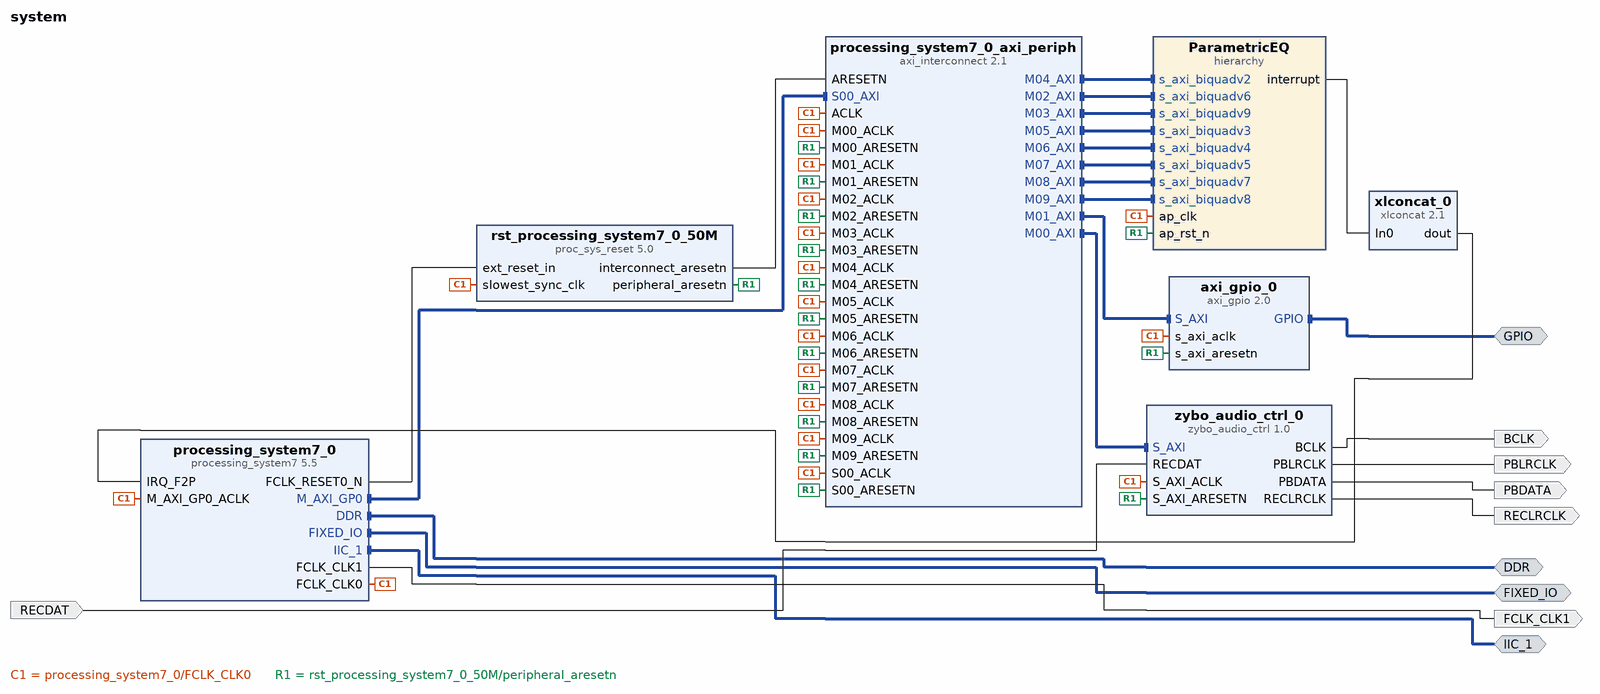
[diagram p0: block diagram of the top level]
# Vivado block design system, xc7z010clg400-1, Vivado 2017.2
create_bd_design system

create_bd_intf_port -mode Master -vlnv xilinx.com:interface:ddrx_rtl:1.0 DDR
create_bd_intf_port -mode Master -vlnv xilinx.com:display_processing_system7:fixedio_rtl:1.0 FIXED_IO
create_bd_intf_port -mode Master -vlnv xilinx.com:interface:iic_rtl:1.0 IIC_1
create_bd_intf_port -mode Master -vlnv xilinx.com:interface:gpio_rtl:1.0 GPIO
create_bd_port -dir O BCLK
create_bd_port -dir O PBLRCLK
create_bd_port -dir O RECLRCLK
create_bd_port -dir O PBDATA
create_bd_port -dir I RECDAT
create_bd_port -dir O -type clk FCLK_CLK1

create_bd_cell -type ip -vlnv xilinx.com:ip:processing_system7:5.5 processing_system7_0
set_property -dict [list \
  CONFIG.PCW_UIPARAM_DDR_FREQ_MHZ 525 \
  CONFIG.PCW_CRYSTAL_PERIPHERAL_FREQMHZ 50.000000 \
  CONFIG.PCW_APU_PERIPHERAL_FREQMHZ 650 \
  CONFIG.PCW_FPGA0_PERIPHERAL_FREQMHZ 100 \
  CONFIG.PCW_FPGA1_PERIPHERAL_FREQMHZ 12.288 \
  CONFIG.PCW_USE_FABRIC_INTERRUPT 1 \
  CONFIG.PCW_EN_CLK1_PORT 1 \
  CONFIG.PCW_IRQ_F2P_INTR 1 \
  CONFIG.PCW_GP0_EN_MODIFIABLE_TXN 0 \
  CONFIG.PCW_GP1_EN_MODIFIABLE_TXN 0 \
  CONFIG.PCW_PRESET_BANK1_VOLTAGE {LVCMOS 1.8V} \
  CONFIG.PCW_UIPARAM_DDR_PARTNO {MT41K128M16 JT-125} \
  CONFIG.PCW_QSPI_PERIPHERAL_ENABLE 0 \
  CONFIG.PCW_ENET0_PERIPHERAL_ENABLE 0 \
  CONFIG.PCW_SD0_PERIPHERAL_ENABLE 0 \
  CONFIG.PCW_UART1_PERIPHERAL_ENABLE 1 \
  CONFIG.PCW_UART1_UART1_IO {MIO 48 .. 49} \
  CONFIG.PCW_USB0_PERIPHERAL_ENABLE 0 \
  CONFIG.PCW_I2C1_PERIPHERAL_ENABLE 1 \
  CONFIG.PCW_I2C1_I2C1_IO EMIO \
  CONFIG.PCW_GPIO_MIO_GPIO_ENABLE 0 \
] [get_bd_cells processing_system7_0]
# 44 more settings of processing_system7_0 are not shown: defaults, MIO pin electricals, DDR timing, and values the tool derives
create_bd_cell -type ip -vlnv xilinx.com:ip:axi_interconnect:2.1 processing_system7_0_axi_periph
set_property -dict {CONFIG.NUM_MI 10} [get_bd_cells processing_system7_0_axi_periph]
create_bd_cell -type ip -vlnv xilinx.com:ip:proc_sys_reset:5.0 rst_processing_system7_0_50M
create_bd_cell -type ip -vlnv xilinx.com:xilinx:zybo_audio_ctrl:1.0 zybo_audio_ctrl_0
create_bd_cell -type ip -vlnv xilinx.com:ip:axi_gpio:2.0 axi_gpio_0
set_property -dict {CONFIG.C_GPIO_WIDTH 1 CONFIG.C_ALL_INPUTS 0 CONFIG.C_ALL_OUTPUTS 1} [get_bd_cells axi_gpio_0]
create_bd_cell -type ip -vlnv xilinx.com:ip:xlconcat:2.1 xlconcat_0
set_property -dict {CONFIG.NUM_PORTS 1} [get_bd_cells xlconcat_0]
create_bd_cell -type hier ParametricEQ

# ---- hierarchy /ParametricEQ ----
current_bd_instance /ParametricEQ
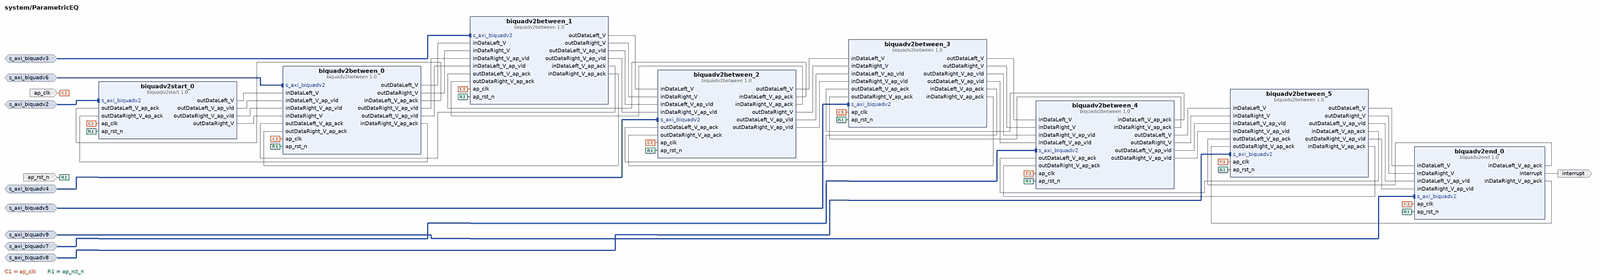
[diagram p1: block diagram inside /ParametricEQ, whole]
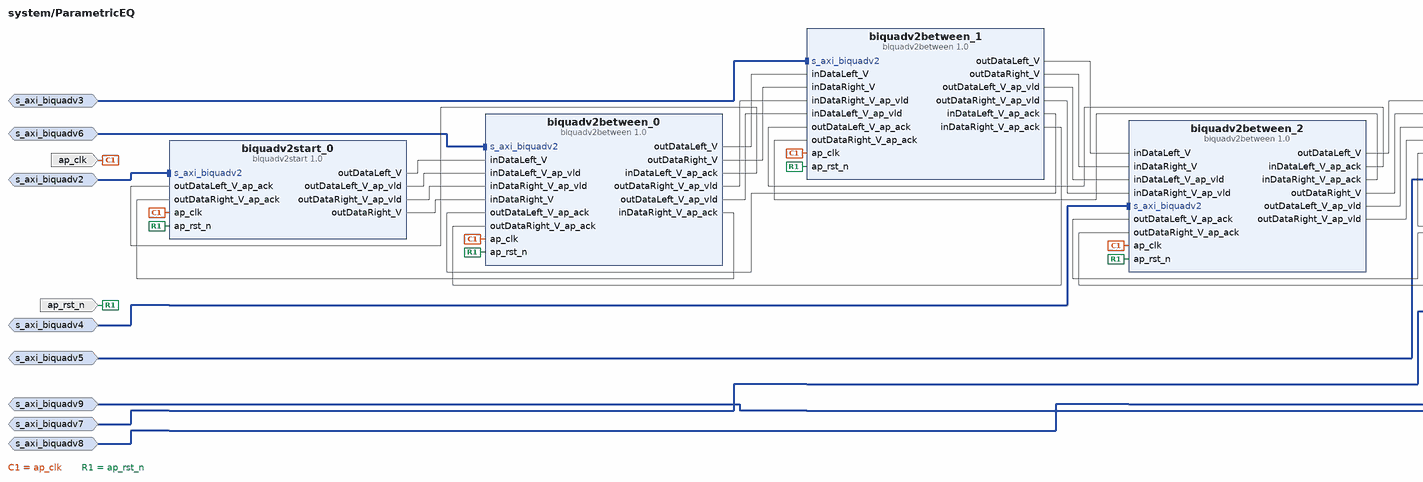
[diagram p2: block diagram inside /ParametricEQ, left part]
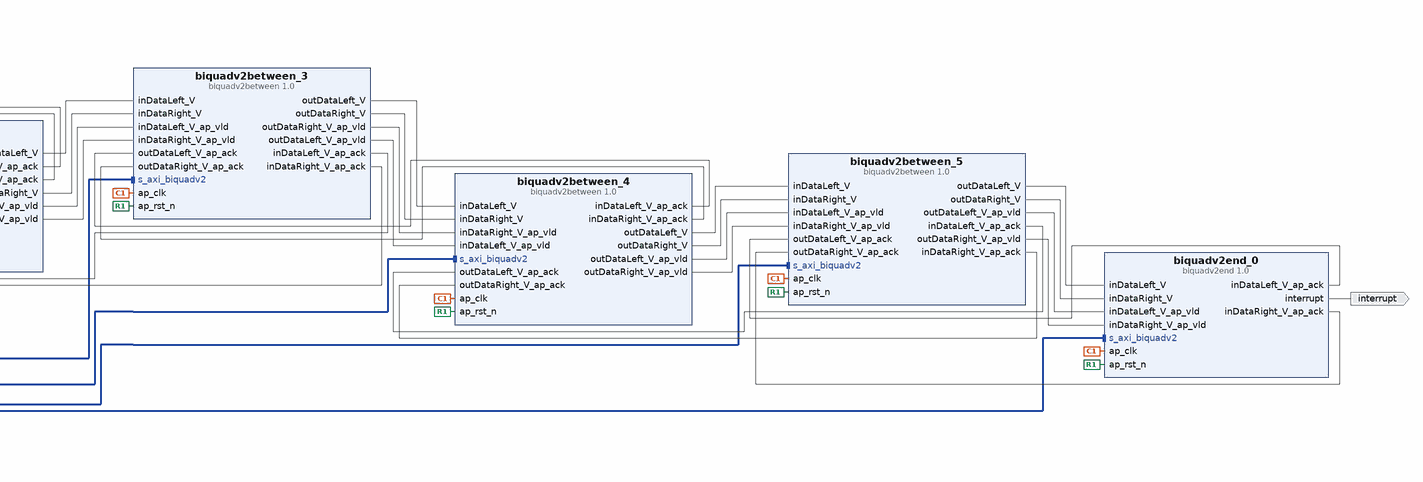
[diagram p3: block diagram inside /ParametricEQ, right part]
create_bd_intf_pin -mode Slave -vlnv xilinx.com:interface:aximm_rtl:1.0 s_axi_biquadv2
create_bd_intf_pin -mode Slave -vlnv xilinx.com:interface:aximm_rtl:1.0 s_axi_biquadv6
create_bd_intf_pin -mode Slave -vlnv xilinx.com:interface:aximm_rtl:1.0 s_axi_biquadv9
create_bd_intf_pin -mode Slave -vlnv xilinx.com:interface:aximm_rtl:1.0 s_axi_biquadv3
create_bd_intf_pin -mode Slave -vlnv xilinx.com:interface:aximm_rtl:1.0 s_axi_biquadv4
create_bd_intf_pin -mode Slave -vlnv xilinx.com:interface:aximm_rtl:1.0 s_axi_biquadv5
create_bd_intf_pin -mode Slave -vlnv xilinx.com:interface:aximm_rtl:1.0 s_axi_biquadv7
create_bd_intf_pin -mode Slave -vlnv xilinx.com:interface:aximm_rtl:1.0 s_axi_biquadv8
create_bd_pin -dir I -type clk ap_clk
create_bd_pin -dir I -type rst ap_rst_n
create_bd_pin -dir O -type intr interrupt

create_bd_cell -type ip -vlnv xilinx.com:hls:biquadv2start:1.0 biquadv2start_0
create_bd_cell -type ip -vlnv xilinx.com:hls:biquadv2between:1.0 biquadv2between_0
create_bd_cell -type ip -vlnv xilinx.com:hls:biquadv2end:1.0 biquadv2end_0
create_bd_cell -type ip -vlnv xilinx.com:hls:biquadv2between:1.0 biquadv2between_1
create_bd_cell -type ip -vlnv xilinx.com:hls:biquadv2between:1.0 biquadv2between_2
create_bd_cell -type ip -vlnv xilinx.com:hls:biquadv2between:1.0 biquadv2between_3
create_bd_cell -type ip -vlnv xilinx.com:hls:biquadv2between:1.0 biquadv2between_4
create_bd_cell -type ip -vlnv xilinx.com:hls:biquadv2between:1.0 biquadv2between_5

# ---- connections ----

current_bd_instance /ParametricEQ
connect_bd_intf_net [get_bd_intf_pins s_axi_biquadv2] [get_bd_intf_pins biquadv2start_0/s_axi_biquadv2]
connect_bd_intf_net [get_bd_intf_pins s_axi_biquadv6] [get_bd_intf_pins biquadv2between_0/s_axi_biquadv2]
connect_bd_intf_net [get_bd_intf_pins s_axi_biquadv9] [get_bd_intf_pins biquadv2end_0/s_axi_biquadv2]
connect_bd_intf_net [get_bd_intf_pins s_axi_biquadv3] [get_bd_intf_pins biquadv2between_1/s_axi_biquadv2]
connect_bd_intf_net [get_bd_intf_pins s_axi_biquadv4] [get_bd_intf_pins biquadv2between_2/s_axi_biquadv2]
connect_bd_intf_net [get_bd_intf_pins s_axi_biquadv5] [get_bd_intf_pins biquadv2between_3/s_axi_biquadv2]
connect_bd_intf_net [get_bd_intf_pins s_axi_biquadv7] [get_bd_intf_pins biquadv2between_4/s_axi_biquadv2]
connect_bd_intf_net [get_bd_intf_pins s_axi_biquadv8] [get_bd_intf_pins biquadv2between_5/s_axi_biquadv2]
connect_bd_net -net biquadv2start_0_left_outDataLeft_V [get_bd_pins biquadv2start_0/outDataLeft_V] [get_bd_pins biquadv2between_0/inDataLeft_V]
connect_bd_net [get_bd_pins ap_clk] \
  [get_bd_pins biquadv2start_0/ap_clk] [get_bd_pins biquadv2between_0/ap_clk] [get_bd_pins biquadv2end_0/ap_clk] \
  [get_bd_pins biquadv2between_1/ap_clk] [get_bd_pins biquadv2between_2/ap_clk] [get_bd_pins biquadv2between_3/ap_clk] \
  [get_bd_pins biquadv2between_4/ap_clk] [get_bd_pins biquadv2between_5/ap_clk]
connect_bd_net [get_bd_pins ap_rst_n] \
  [get_bd_pins biquadv2start_0/ap_rst_n] [get_bd_pins biquadv2between_0/ap_rst_n] [get_bd_pins biquadv2end_0/ap_rst_n] \
  [get_bd_pins biquadv2between_1/ap_rst_n] [get_bd_pins biquadv2between_2/ap_rst_n] [get_bd_pins biquadv2between_3/ap_rst_n] \
  [get_bd_pins biquadv2between_4/ap_rst_n] [get_bd_pins biquadv2between_5/ap_rst_n]
connect_bd_net [get_bd_pins biquadv2end_0/interrupt] [get_bd_pins interrupt]
connect_bd_net -net biquadv2start_0_left_outDataLeft_V_ap_vld [get_bd_pins biquadv2start_0/outDataLeft_V_ap_vld] \
  [get_bd_pins biquadv2between_0/inDataLeft_V_ap_vld]
connect_bd_net -net biquadv2between_0_left_inDataLeft_V_ap_ack [get_bd_pins biquadv2between_0/inDataLeft_V_ap_ack] \
  [get_bd_pins biquadv2start_0/outDataLeft_V_ap_ack]
connect_bd_net -net biquadv2start_0_left_outDataRight_V_ap_vld [get_bd_pins biquadv2start_0/outDataRight_V_ap_vld] \
  [get_bd_pins biquadv2between_0/inDataRight_V_ap_vld]
connect_bd_net -net biquadv2start_0_left_outDataRight_V [get_bd_pins biquadv2start_0/outDataRight_V] [get_bd_pins biquadv2between_0/inDataRight_V]
connect_bd_net -net biquadv2between_0_left_inDataRight_V_ap_ack [get_bd_pins biquadv2between_0/inDataRight_V_ap_ack] \
  [get_bd_pins biquadv2start_0/outDataRight_V_ap_ack]
connect_bd_net [get_bd_pins biquadv2between_0/outDataLeft_V] [get_bd_pins biquadv2between_1/inDataLeft_V]
connect_bd_net [get_bd_pins biquadv2between_0/outDataRight_V] [get_bd_pins biquadv2between_1/inDataRight_V]
connect_bd_net [get_bd_pins biquadv2between_0/outDataRight_V_ap_vld] [get_bd_pins biquadv2between_1/inDataRight_V_ap_vld]
connect_bd_net [get_bd_pins biquadv2between_0/outDataLeft_V_ap_vld] [get_bd_pins biquadv2between_1/inDataLeft_V_ap_vld]
connect_bd_net [get_bd_pins biquadv2between_1/inDataLeft_V_ap_ack] [get_bd_pins biquadv2between_0/outDataLeft_V_ap_ack]
connect_bd_net [get_bd_pins biquadv2between_1/inDataRight_V_ap_ack] [get_bd_pins biquadv2between_0/outDataRight_V_ap_ack]
connect_bd_net [get_bd_pins biquadv2between_1/outDataLeft_V] [get_bd_pins biquadv2between_2/inDataLeft_V]
connect_bd_net [get_bd_pins biquadv2between_1/outDataRight_V] [get_bd_pins biquadv2between_2/inDataRight_V]
connect_bd_net [get_bd_pins biquadv2between_1/outDataLeft_V_ap_vld] [get_bd_pins biquadv2between_2/inDataLeft_V_ap_vld]
connect_bd_net [get_bd_pins biquadv2between_1/outDataRight_V_ap_vld] [get_bd_pins biquadv2between_2/inDataRight_V_ap_vld]
connect_bd_net [get_bd_pins biquadv2between_2/inDataLeft_V_ap_ack] [get_bd_pins biquadv2between_1/outDataLeft_V_ap_ack]
connect_bd_net [get_bd_pins biquadv2between_2/inDataRight_V_ap_ack] [get_bd_pins biquadv2between_1/outDataRight_V_ap_ack]
connect_bd_net [get_bd_pins biquadv2between_2/outDataLeft_V] [get_bd_pins biquadv2between_3/inDataLeft_V]
connect_bd_net [get_bd_pins biquadv2between_2/outDataRight_V] [get_bd_pins biquadv2between_3/inDataRight_V]
connect_bd_net [get_bd_pins biquadv2between_2/outDataLeft_V_ap_vld] [get_bd_pins biquadv2between_3/inDataLeft_V_ap_vld]
connect_bd_net [get_bd_pins biquadv2between_2/outDataRight_V_ap_vld] [get_bd_pins biquadv2between_3/inDataRight_V_ap_vld]
connect_bd_net [get_bd_pins biquadv2between_3/inDataLeft_V_ap_ack] [get_bd_pins biquadv2between_2/outDataLeft_V_ap_ack]
connect_bd_net [get_bd_pins biquadv2between_3/inDataRight_V_ap_ack] [get_bd_pins biquadv2between_2/outDataRight_V_ap_ack]
connect_bd_net [get_bd_pins biquadv2between_3/outDataLeft_V] [get_bd_pins biquadv2between_4/inDataLeft_V]
connect_bd_net [get_bd_pins biquadv2between_3/outDataRight_V] [get_bd_pins biquadv2between_4/inDataRight_V]
connect_bd_net [get_bd_pins biquadv2between_3/outDataRight_V_ap_vld] [get_bd_pins biquadv2between_4/inDataRight_V_ap_vld]
connect_bd_net [get_bd_pins biquadv2between_3/outDataLeft_V_ap_vld] [get_bd_pins biquadv2between_4/inDataLeft_V_ap_vld]
connect_bd_net [get_bd_pins biquadv2between_4/inDataLeft_V_ap_ack] [get_bd_pins biquadv2between_3/outDataLeft_V_ap_ack]
connect_bd_net [get_bd_pins biquadv2between_4/inDataRight_V_ap_ack] [get_bd_pins biquadv2between_3/outDataRight_V_ap_ack]
connect_bd_net [get_bd_pins biquadv2between_4/outDataLeft_V] [get_bd_pins biquadv2between_5/inDataLeft_V]
connect_bd_net [get_bd_pins biquadv2between_4/outDataRight_V] [get_bd_pins biquadv2between_5/inDataRight_V]
connect_bd_net [get_bd_pins biquadv2between_4/outDataLeft_V_ap_vld] [get_bd_pins biquadv2between_5/inDataLeft_V_ap_vld]
connect_bd_net [get_bd_pins biquadv2between_4/outDataRight_V_ap_vld] [get_bd_pins biquadv2between_5/inDataRight_V_ap_vld]
connect_bd_net [get_bd_pins biquadv2between_5/inDataLeft_V_ap_ack] [get_bd_pins biquadv2between_4/outDataLeft_V_ap_ack]
connect_bd_net [get_bd_pins biquadv2between_5/inDataRight_V_ap_ack] [get_bd_pins biquadv2between_4/outDataRight_V_ap_ack]
connect_bd_net [get_bd_pins biquadv2between_5/outDataLeft_V] [get_bd_pins biquadv2end_0/inDataLeft_V]
connect_bd_net [get_bd_pins biquadv2between_5/outDataRight_V] [get_bd_pins biquadv2end_0/inDataRight_V]
connect_bd_net [get_bd_pins biquadv2between_5/outDataLeft_V_ap_vld] [get_bd_pins biquadv2end_0/inDataLeft_V_ap_vld]
connect_bd_net [get_bd_pins biquadv2between_5/outDataRight_V_ap_vld] [get_bd_pins biquadv2end_0/inDataRight_V_ap_vld]
connect_bd_net [get_bd_pins biquadv2end_0/inDataLeft_V_ap_ack] [get_bd_pins biquadv2between_5/outDataLeft_V_ap_ack]
connect_bd_net [get_bd_pins biquadv2end_0/inDataRight_V_ap_ack] [get_bd_pins biquadv2between_5/outDataRight_V_ap_ack]

current_bd_instance /
connect_bd_intf_net [get_bd_intf_pins processing_system7_0/M_AXI_GP0] [get_bd_intf_pins processing_system7_0_axi_periph/S00_AXI]
connect_bd_intf_net [get_bd_intf_pins processing_system7_0_axi_periph/M00_AXI] [get_bd_intf_pins zybo_audio_ctrl_0/S_AXI]
connect_bd_intf_net [get_bd_intf_pins processing_system7_0_axi_periph/M01_AXI] [get_bd_intf_pins axi_gpio_0/S_AXI]
connect_bd_intf_net [get_bd_intf_pins processing_system7_0_axi_periph/M04_AXI] [get_bd_intf_pins ParametricEQ/s_axi_biquadv2]
connect_bd_intf_net [get_bd_intf_pins processing_system7_0_axi_periph/M02_AXI] [get_bd_intf_pins ParametricEQ/s_axi_biquadv6]
connect_bd_intf_net [get_bd_intf_pins processing_system7_0_axi_periph/M03_AXI] [get_bd_intf_pins ParametricEQ/s_axi_biquadv9]
connect_bd_intf_net [get_bd_intf_pins processing_system7_0_axi_periph/M05_AXI] [get_bd_intf_pins ParametricEQ/s_axi_biquadv3]
connect_bd_intf_net [get_bd_intf_pins processing_system7_0_axi_periph/M06_AXI] [get_bd_intf_pins ParametricEQ/s_axi_biquadv4]
connect_bd_intf_net [get_bd_intf_pins processing_system7_0_axi_periph/M07_AXI] [get_bd_intf_pins ParametricEQ/s_axi_biquadv5]
connect_bd_intf_net [get_bd_intf_pins processing_system7_0_axi_periph/M08_AXI] [get_bd_intf_pins ParametricEQ/s_axi_biquadv7]
connect_bd_intf_net [get_bd_intf_pins processing_system7_0_axi_periph/M09_AXI] [get_bd_intf_pins ParametricEQ/s_axi_biquadv8]
connect_bd_intf_net [get_bd_intf_ports DDR] [get_bd_intf_pins processing_system7_0/DDR]
connect_bd_intf_net [get_bd_intf_ports FIXED_IO] [get_bd_intf_pins processing_system7_0/FIXED_IO]
connect_bd_intf_net [get_bd_intf_ports IIC_1] [get_bd_intf_pins processing_system7_0/IIC_1]
connect_bd_intf_net [get_bd_intf_ports GPIO] [get_bd_intf_pins axi_gpio_0/GPIO]
connect_bd_net [get_bd_pins processing_system7_0/FCLK_RESET0_N] [get_bd_pins rst_processing_system7_0_50M/ext_reset_in]
connect_bd_net [get_bd_pins rst_processing_system7_0_50M/interconnect_aresetn] [get_bd_pins processing_system7_0_axi_periph/ARESETN]
connect_bd_net [get_bd_pins zybo_audio_ctrl_0/BCLK] [get_bd_ports BCLK]
connect_bd_net [get_bd_pins zybo_audio_ctrl_0/PBLRCLK] [get_bd_ports PBLRCLK]
connect_bd_net [get_bd_pins zybo_audio_ctrl_0/RECLRCLK] [get_bd_ports RECLRCLK]
connect_bd_net [get_bd_pins zybo_audio_ctrl_0/PBDATA] [get_bd_ports PBDATA]
connect_bd_net [get_bd_ports RECDAT] [get_bd_pins zybo_audio_ctrl_0/RECDAT]
connect_bd_net [get_bd_pins processing_system7_0/FCLK_CLK1] [get_bd_ports FCLK_CLK1]
connect_bd_net [get_bd_pins xlconcat_0/dout] [get_bd_pins processing_system7_0/IRQ_F2P]
connect_bd_net [get_bd_pins processing_system7_0/FCLK_CLK0] \
  [get_bd_pins processing_system7_0/M_AXI_GP0_ACLK] [get_bd_pins rst_processing_system7_0_50M/slowest_sync_clk] \
  [get_bd_pins zybo_audio_ctrl_0/S_AXI_ACLK] [get_bd_pins axi_gpio_0/s_axi_aclk] \
  [get_bd_pins processing_system7_0_axi_periph/S00_ACLK] [get_bd_pins processing_system7_0_axi_periph/ACLK] \
  [get_bd_pins processing_system7_0_axi_periph/M00_ACLK] [get_bd_pins processing_system7_0_axi_periph/M01_ACLK] \
  [get_bd_pins processing_system7_0_axi_periph/M02_ACLK] [get_bd_pins processing_system7_0_axi_periph/M03_ACLK] \
  [get_bd_pins ParametricEQ/ap_clk] [get_bd_pins processing_system7_0_axi_periph/M04_ACLK] \
  [get_bd_pins processing_system7_0_axi_periph/M05_ACLK] [get_bd_pins processing_system7_0_axi_periph/M06_ACLK] \
  [get_bd_pins processing_system7_0_axi_periph/M07_ACLK] [get_bd_pins processing_system7_0_axi_periph/M08_ACLK] \
  [get_bd_pins processing_system7_0_axi_periph/M09_ACLK]
connect_bd_net [get_bd_pins rst_processing_system7_0_50M/peripheral_aresetn] \
  [get_bd_pins zybo_audio_ctrl_0/S_AXI_ARESETN] [get_bd_pins axi_gpio_0/s_axi_aresetn] \
  [get_bd_pins processing_system7_0_axi_periph/S00_ARESETN] [get_bd_pins processing_system7_0_axi_periph/M00_ARESETN] \
  [get_bd_pins processing_system7_0_axi_periph/M01_ARESETN] [get_bd_pins processing_system7_0_axi_periph/M02_ARESETN] \
  [get_bd_pins processing_system7_0_axi_periph/M03_ARESETN] [get_bd_pins ParametricEQ/ap_rst_n] \
  [get_bd_pins processing_system7_0_axi_periph/M04_ARESETN] [get_bd_pins processing_system7_0_axi_periph/M05_ARESETN] \
  [get_bd_pins processing_system7_0_axi_periph/M06_ARESETN] [get_bd_pins processing_system7_0_axi_periph/M07_ARESETN] \
  [get_bd_pins processing_system7_0_axi_periph/M08_ARESETN] [get_bd_pins processing_system7_0_axi_periph/M09_ARESETN]
connect_bd_net -net hier_0_interrupt [get_bd_pins ParametricEQ/interrupt] [get_bd_pins xlconcat_0/In0]

# ---- address map ----
assign_bd_address -offset 0x41200000 -range 64K -target_address_space [get_bd_addr_spaces processing_system7_0/Data] [get_bd_addr_segs axi_gpio_0/S_AXI/Reg]
assign_bd_address -offset 0x43C00000 -range 64K -target_address_space [get_bd_addr_spaces processing_system7_0/Data] [get_bd_addr_segs ParametricEQ/biquadv2between_0/s_axi_biquadv2/Reg]
assign_bd_address -offset 0x43C10000 -range 64K -target_address_space [get_bd_addr_spaces processing_system7_0/Data] [get_bd_addr_segs ParametricEQ/biquadv2end_0/s_axi_biquadv2/Reg]
assign_bd_address -offset 0x43C20000 -range 64K -target_address_space [get_bd_addr_spaces processing_system7_0/Data] [get_bd_addr_segs ParametricEQ/biquadv2start_0/s_axi_biquadv2/Reg]
assign_bd_address -offset 0x43C30000 -range 64K -target_address_space [get_bd_addr_spaces processing_system7_0/Data] [get_bd_addr_segs ParametricEQ/biquadv2between_1/s_axi_biquadv2/Reg]
assign_bd_address -offset 0x43C40000 -range 64K -target_address_space [get_bd_addr_spaces processing_system7_0/Data] [get_bd_addr_segs ParametricEQ/biquadv2between_2/s_axi_biquadv2/Reg]
assign_bd_address -offset 0x43C50000 -range 64K -target_address_space [get_bd_addr_spaces processing_system7_0/Data] [get_bd_addr_segs ParametricEQ/biquadv2between_3/s_axi_biquadv2/Reg]
assign_bd_address -offset 0x43C60000 -range 64K -target_address_space [get_bd_addr_spaces processing_system7_0/Data] [get_bd_addr_segs ParametricEQ/biquadv2between_4/s_axi_biquadv2/Reg]
assign_bd_address -offset 0x43C70000 -range 64K -target_address_space [get_bd_addr_spaces processing_system7_0/Data] [get_bd_addr_segs ParametricEQ/biquadv2between_5/s_axi_biquadv2/Reg]
assign_bd_address -offset 0x60000000 -range 512M -target_address_space [get_bd_addr_spaces processing_system7_0/Data] [get_bd_addr_segs zybo_audio_ctrl_0/S_AXI/reg0]

validate_bd_design
save_bd_design
